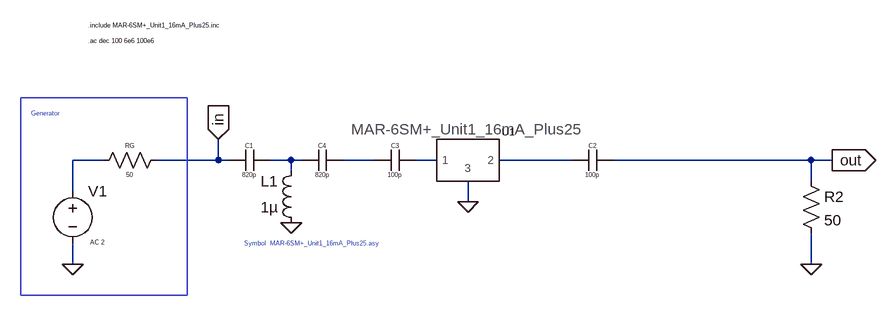
[diagram p0: schematic MAR-6_Test_Circuit.asc]
MAR-6_Test_Circuit.asc, the LTspice schematic file:
Version 4
SHEET 1 1056 680
WIRE -160 128 -208 128
WIRE 16 128 16 96
WIRE 16 128 -80 128
WIRE 32 128 16 128
WIRE 128 128 96 128
WIRE 144 128 128 128
WIRE 256 128 208 128
WIRE 352 128 320 128
WIRE 560 128 448 128
WIRE 928 128 624 128
WIRE 960 128 928 128
WIRE 128 144 128 128
WIRE 928 160 928 128
WIRE -208 176 -208 128
WIRE 400 192 400 160
WIRE -208 288 -208 256
WIRE 928 288 928 240
FLAG 928 288 0
FLAG -208 288 0
FLAG 400 192 0
FLAG 960 128 out
IOPIN 960 128 Out
FLAG 16 96 in
IOPIN 16 96 In
FLAG 128 224 0
SYMBOL voltage -208 160 R0
WINDOW 123 27 94 Left 0
WINDOW 39 0 0 Left 0
SYMATTR Value2 AC 2
SYMATTR InstName V1
SYMATTR Value ""
SYMBOL res -176 144 R270
WINDOW 0 32 56 VTop 0
WINDOW 3 0 56 VBottom 0
SYMATTR InstName RG
SYMATTR Value 50
SYMBOL res 912 144 R0
SYMATTR InstName R2
SYMATTR Value 50
SYMBOL cap 560 144 R270
WINDOW 0 32 32 VTop 0
WINDOW 3 0 32 VBottom 0
SYMATTR InstName C2
SYMATTR Value 100p
SYMBOL cap 32 144 R270
WINDOW 0 32 32 VTop 0
WINDOW 3 0 32 VBottom 0
SYMATTR InstName C1
SYMATTR Value 820p
SYMBOL MAR-6SM+_Unit1_16mA_Plus25 400 128 R0
SYMATTR Value MAR-6SM+_Unit1_16mA_Plus25
SYMATTR InstName U1
SYMBOL ind 144 240 R180
WINDOW 0 36 80 Left 2
WINDOW 3 36 40 Left 2
SYMATTR InstName L1
SYMATTR Value 1µ
SYMBOL cap 144 144 R270
WINDOW 0 32 32 VTop 0
WINDOW 3 0 32 VBottom 0
SYMATTR InstName C4
SYMATTR Value 820p
SYMBOL cap 256 144 R270
WINDOW 0 32 32 VTop 0
WINDOW 3 0 32 VBottom 0
SYMATTR InstName C3
SYMATTR Value 100p
TEXT -184 -56 Left 0 !.ac dec 100 6e6 100e6
TEXT -272 56 Left 0 ;Generator
TEXT 56 256 Left 0 ;Symbol  MAR-6SM+_Unit1_16mA_Plus25.asy
TEXT -184 -80 Left 0 !.include MAR-6SM+_Unit1_16mA_Plus25.inc
RECTANGLE Normal -32 336 -288 32

The netlist it stands for:
* MAR-6_Test_Circuit.asc
V1 N001 0 AC 2
RG N001 in 50
R2 out 0 50
C2 N005 out 100p
C1 in N002 820p
XU1 N004 N005 0 MAR-6SM+_Unit1_16mA_Plus25 MAR-6SM+_Unit1_16mA_Plus25  ; pins 1 2 3
L1 0 N002 1µ
C4 N002 N003 820p
C3 N003 N004 100p
.ac dec 100 6e6 100e6
* Generator
* Symbol  MAR-6SM+_Unit1_16mA_Plus25.asy
.include MAR-6SM+_Unit1_16mA_Plus25.inc
.lib MAR-6SM+_Unit1_16mA_Plus25.inc
.backanno
.end

* Results of the author's LTspice run, read from the files saved beside the schematic
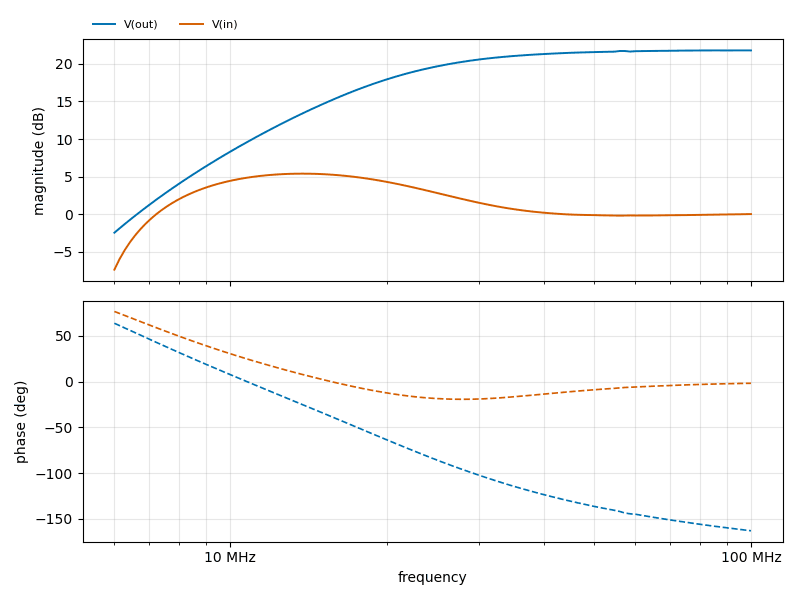
[diagram p1: AC Analysis of MAR-6_Test_Circuit.asc, plotted from the saved traces]
* AC Analysis, 1 run:
*   V(out): -2.45 dB at 6 MHz, 21.77 dB at 100 MHz, peak 21.78 dB at 95.09 MHz, 3 dB below the peak at 22.01 MHz
*   V(in): -7.36 dB at 6 MHz, 0.03 dB at 100 MHz, peak 5.40 dB at 13.75 MHz, 3 dB below the peak at 8.185 MHz and 26.55 MHz